# Altium schematic sheet Coplanar Capacitive Sensor.SchDoc: PCB Coplanar Capacitive Sensor
size Letter; Date: 2014-12-09; Revision: A; DesignedBy: Craig Comberbach
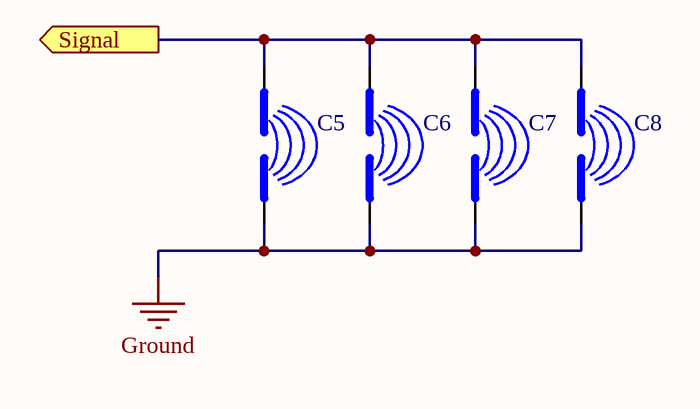
[diagram p0: Coplanar Capacitive Sensor.SchDoc]

## Parts
C5  Coplanar Capacitor  [Coplanar Capacitor]  (value not drawn)  (no BOM)
C6  Coplanar Capacitor  [Coplanar Capacitor]  (value not drawn)  (no BOM)
C7  Coplanar Capacitor  [Coplanar Capacitor]  (value not drawn)  (no BOM)
C8  Coplanar Capacitor  [Coplanar Capacitor]  (value not drawn)  (no BOM)

## Ports
Signal (out)

## Nets
Ground: C5.1 C6.1 C7.1 C8.1
Signal: C5.2 C6.2 C7.2 C8.2 ; port Signal

## Notes on the sheet
- Cct
- Designed by
- Rev
- Date
- Sheet
- of